# Altium schematic sheet Port F Output Port.SchDoc: Port F Output Port
size 292 x 193 mm; SheetNumber: 6; SheetTotal: 28
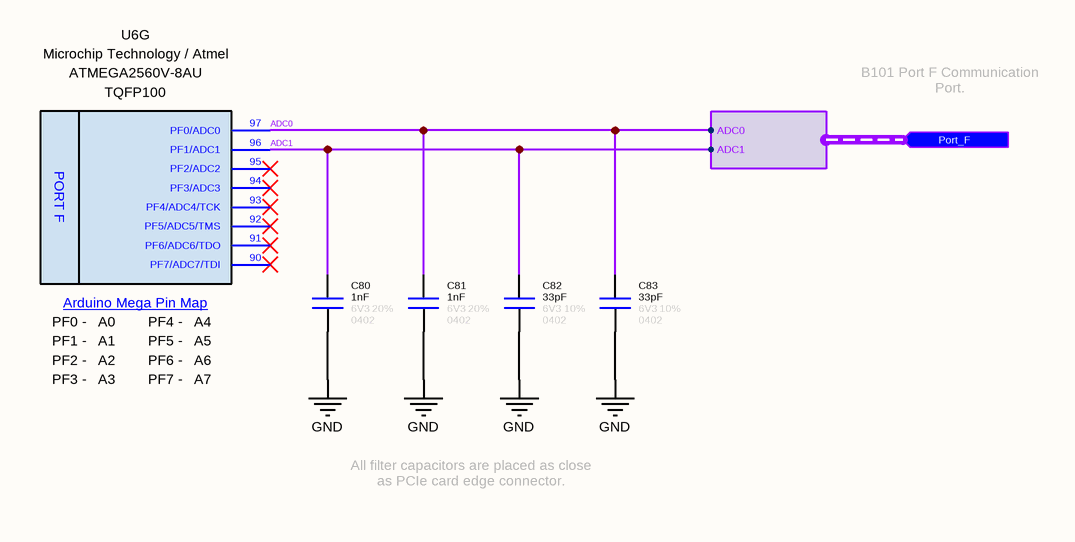
[diagram p0: Port F Output Port.SchDoc]

## Parts
C80  value 1nF  Tolerance: 20%  Case: 0402  Voltage: 6V3  [CAPACITOR_0402]  (hidden comment: Capacitor - 1nF [0402] (Ceramic))
C81  value 1nF  Tolerance: 20%  Case: 0402  Voltage: 6V3  [CAPACITOR_0402]  (hidden comment: Capacitor - 1nF [0402] (Ceramic))
C82  value 33pF  Tolerance: 10%  Case: 0402  Voltage: 6V3  [CAPACITOR_0402]  (hidden comment: Capacitor - 33pF [0402] (Ceramic))
C83  value 33pF  Tolerance: 10%  Case: 0402  Voltage: 6V3  [CAPACITOR_0402]  (hidden comment: Capacitor - 33pF [0402] (Ceramic))
U6  Manufacturer Name: Microchip Technology / Atmel  Case: TQFP100  [TQFP-100]  (hidden comment: ATMEGA2560V-8AU)  (part G of 16)

## Ports
Port_F (in, harness Port_F)

## Harnesses
Port_F: ADC1, ADC0

## Nets
GND: C80.1 C81.1 C82.1 C83.1
ADC0: C81.2 C83.2 U6.97(PF0/ADC0) ; port Port_F.ADC0
ADC1: C80.2 C82.2 U6.96(PF1/ADC1) ; port Port_F.ADC1

Not connected (* = marked no-connect by the designer): U6 90(PF7/ADC7/TDI)* 91(PF6/ADC6/TDO)* 92(PF5/ADC5/TMS)* 93(PF4/ADC4/TCK)* 94(PF3/ADC3)* 95(PF2/ADC2)*

## Notes on the sheet
- B101 Port F Communication Port.
- All filter capacitors are placed as close as PCIe card edge connector.
- © 2021 All rights reserved.
  This document may not, in whole or in part, be copied, photocopied, reproduced, translated or converted to any electronic or machine readable from without prior written permission of Mehmet Günce Akkoyun.
  Engineer contact : akkoyun@me.com
- Property of
- Engineer :
- Date :
- Size :
- A4
- Time :
- Project :
- Page :
- /
- Customer :
- Product ID :
- Module ID :
- Version :
- File :
- Revision :
- (in symbol IC - AtMega2560V-8AU, part G) PORT F; Arduino Mega Pin Map; PF0 -; A0; PF4 -; A4; PF1 -; A1; PF5 -; A5; PF2 -; A2; PF6 -; A6; PF3 -; A3; PF7 -; A7

## Library data of the parts
C80 C81 = Capacitor - 1nF [0402-6V3]: Manufacturer Name: AVX; Manufacturer Part Number: 04026C102MAT2A; ComponentLink1Description: DataSheet; ComponentLink1URL: https://www.mouser.com.tr/datasheet/2/40/X7RDielectric-777024.pdf
C82 C83 = Capacitor - 33pF [0402-6V3]: Manufacturer Name: Kemet; Manufacturer Part Number: C0402C330J9RACAUTO; ComponentLink1Description: DataSheet; ComponentLink1URL: https://api.kemet.com/component-edge/download/datasheet/C0402C330J9RACAUTO.pdf; ComponentLink2Description: Mouser; ComponentLink2URL: https://www.mouser.com/Search/Refine.aspx?Keyword=80-C0402C330J9RAUTO
U6 = IC - AtMega2560V-8AU: ATmega Series 256 KB Flash 8 KB SRAM 8 MHz 8-Bit Microcontroller - TQFP-100; Program Memory Size: 256 kB; Core: AVR; Operating Supply Voltage: 2.7 V to 5.5 V; Maximum Clock Frequency: 8 MHz; Maximum Operating Temperature: + 85 C; Product Type: MicroControllers; Minimum Operating Temperature: - 40 C; Manufacturer Part Number: ATMEGA2560V-8AU